# Altium project 5DPD8_OS.PrjPcb (part 2 of 2)

## Sheet 5DPD8_v1.0_OS_Sheet3.SchDoc: 5DPD8 Controller
size A4; Date: 10th Mar 14; CheckedBy: J. Wong/C. Lai; CompanyName: Makible Ltd.; DrawnBy: Martyn Kay; Engineer: Martyn Kay; Revision: 1.0; SheetNumber: 3; SheetTotal: 4; Website: 5DPrint.com; DesignFileLink: D8 Design Files; BasedOn: Printrboard Rev. B; OSHWLicense: CC BY-SA 4.0
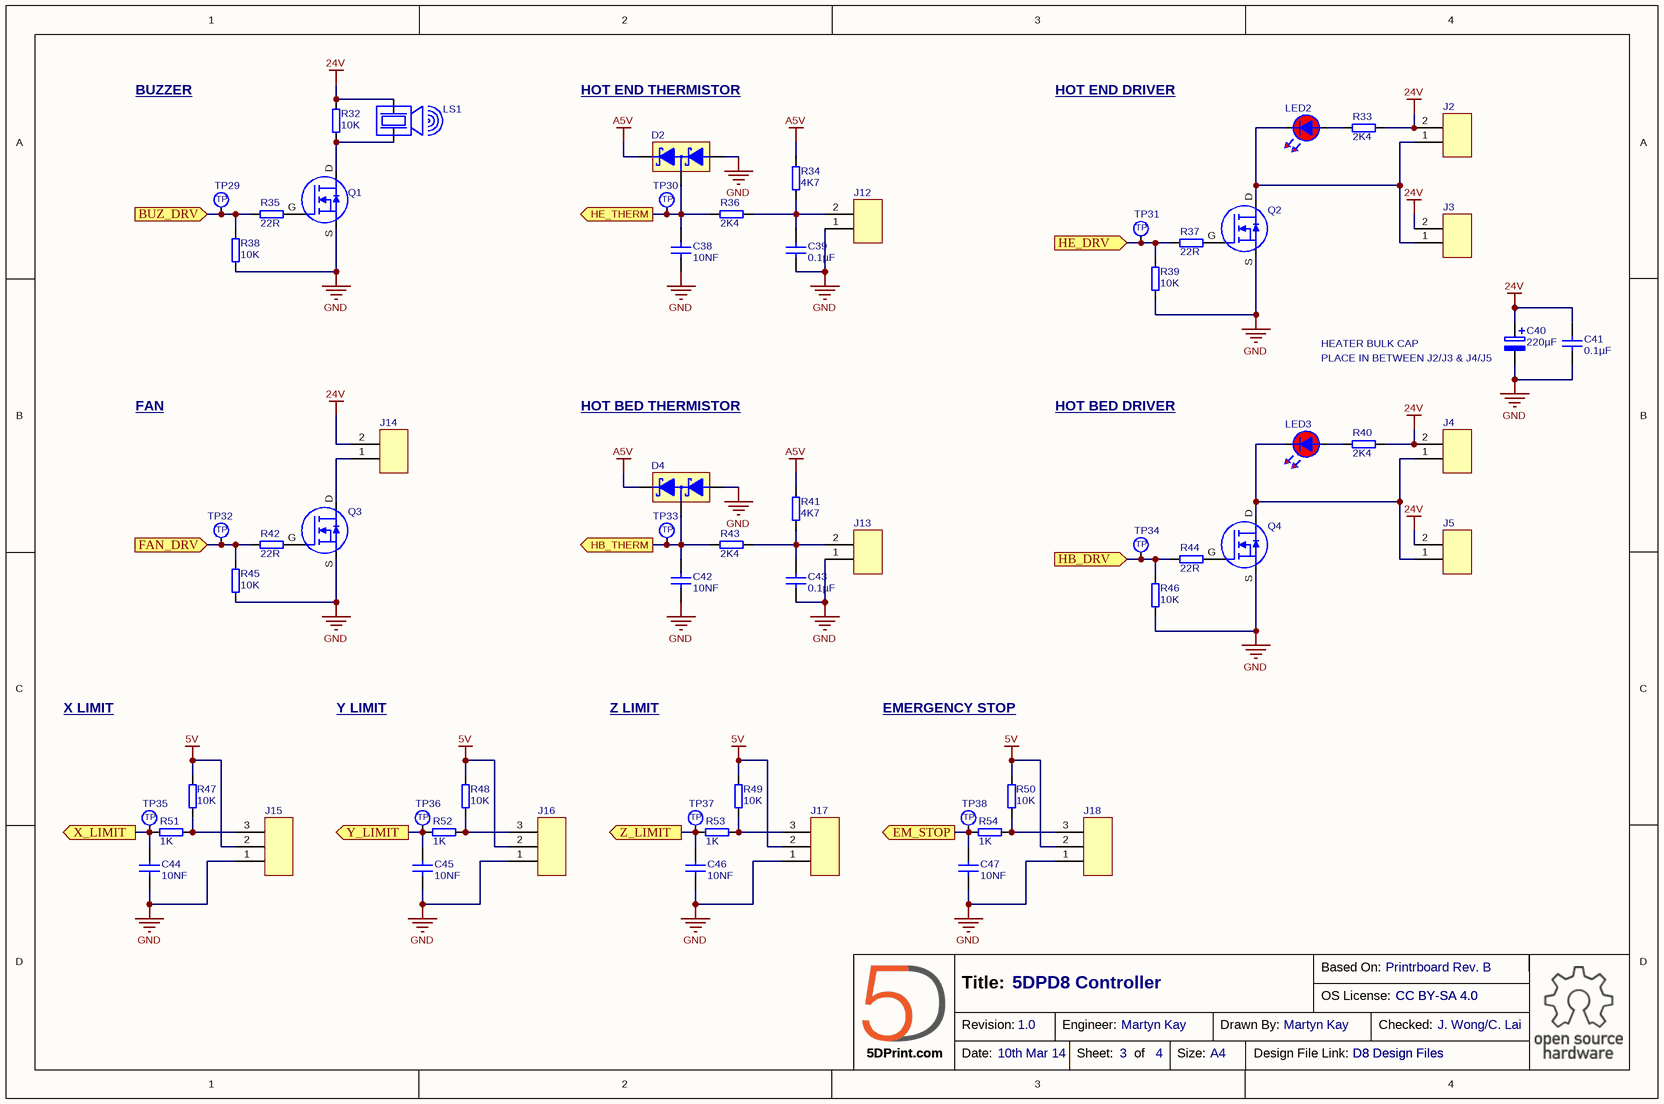
[diagram p2: 5DPD8_v1.0_OS_Sheet3.SchDoc]

### Parts
C38  10NF  [CAPC0603(1608)100_N]
C39  0.1µF  [CAPC0603(1608)100_N]
C40  220µF  [CAPRAD8X11.5]
C41  0.1µF  [CAPC0603(1608)100_N]
C42  10NF  [CAPC0603(1608)100_N]
C43  0.1µF  [CAPC0603(1608)100_N]
C44  10NF  [CAPC0603(1608)100_N]
C45  10NF  [CAPC0603(1608)100_N]
C46  10NF  [CAPC0603(1608)100_N]
C47  10NF  [CAPC0603(1608)100_N]
D2  BAT54S,215  [SOT95P237X112-3N]  (value not drawn)
D4  BAT54S,215  [SOT95P237X112-3N]  (value not drawn)
J2  0039281023  [MOLEX_39-28-1023]  (value not drawn)
J3  0039281023  [MOLEX_39-28-1023]  (value not drawn)
J4  0039281023  [MOLEX_39-28-1023]  (value not drawn)
J5  0039281023  [MOLEX_39-28-1023]  (value not drawn)
J12  0022272021  [MOLEX_22-27-2021]  (value not drawn)
J13  0022272021  [MOLEX_22-27-2021]  (value not drawn)
J14  0022272021  [MOLEX_22-27-2021]  (value not drawn)
J15  0022272031  [MOLEX_22-27-2031]  (value not drawn)
J16  0022272031  [MOLEX_22-27-2031]  (value not drawn)
J17  0022272031  [MOLEX_22-27-2031]  (value not drawn)
J18  0022272031  [MOLEX_22-27-2031]  (value not drawn)
LED2  HSMH-C190  [LEDC0603(1608)_N-RED]  (value not drawn)
LED3  HSMH-C190  [LEDC0603(1608)_N-RED]  (value not drawn)
LS1  PS1740P02E  [PS17]  (value not drawn)
Q1  2N7002,215  [SOT95P237X112-3N-GSD]  (value not drawn)
Q2  PSMN9R5-30YLC,115  [SOT669(LFPAK56)]  (value not drawn)
Q3  IRLML2060TRPBF  [SOT95P237X112-3N-GSD]  (value not drawn)
Q4  PSMN9R5-30YLC,115  [SOT669(LFPAK56)]  (value not drawn)
R32  10K  [RESC0603(1608)_N]
R33  2K4  [RESC0603(1608)_N]
R34  4K7  [RESC0603(1608)_N]
R35  22R  [RESC0603(1608)_N]
R36  2K4  [RESC0603(1608)_N]
R37  22R  [RESC0603(1608)_N]
R38  10K  [RESC0603(1608)_N]
R39  10K  [RESC0603(1608)_N]
R40  2K4  [RESC0603(1608)_N]
R41  4K7  [RESC0603(1608)_N]
R42  22R  [RESC0603(1608)_N]
R43  2K4  [RESC0603(1608)_N]
R44  22R  [RESC0603(1608)_N]
R45  10K  [RESC0603(1608)_N]
R46  10K  [RESC0603(1608)_N]
R47  10K  [RESC0603(1608)_N]
R48  10K  [RESC0603(1608)_N]
R49  10K  [RESC0603(1608)_N]
R50  10K  [RESC0603(1608)_N]
R51  1K  [RESC0603(1608)_N]
R52  1K  [RESC0603(1608)_N]
R53  1K  [RESC0603(1608)_N]
R54  1K  [RESC0603(1608)_N]
TP29  TESTPOINT  [TESTPOINT]  (value not drawn)  (no BOM)
TP30  TESTPOINT  [TESTPOINT]  (value not drawn)  (no BOM)
TP31  TESTPOINT  [TESTPOINT]  (value not drawn)  (no BOM)
TP32  TESTPOINT  [TESTPOINT]  (value not drawn)  (no BOM)
TP33  TESTPOINT  [TESTPOINT]  (value not drawn)  (no BOM)
TP34  TESTPOINT  [TESTPOINT]  (value not drawn)  (no BOM)
TP35  TESTPOINT  [TESTPOINT]  (value not drawn)  (no BOM)
TP36  TESTPOINT  [TESTPOINT]  (value not drawn)  (no BOM)
TP37  TESTPOINT  [TESTPOINT]  (value not drawn)  (no BOM)
TP38  TESTPOINT  [TESTPOINT]  (value not drawn)  (no BOM)

### Ports
BUZ_DRV (in), EM_STOP (out), FAN_DRV (in), HB_DRV (in), HB_THERM (out), HE_DRV (in), HE_THERM (out), X_LIMIT (out), Y_LIMIT (out), Z_LIMIT (out)

### Nets
5V: J15.2 J16.2 J17.2 J18.2 R47.2 R48.2 R49.2 R50.2
24V: C40.1(+) C41.2 J2.2 J3.2 J4.2 J5.2 J14.2 LS1.2 R32.2 R33.2 R40.2
A5V: D2.2 D4.2 R34.2 R41.2
GND: C38.1 C39.1 C40.2(-) C41.1 C42.1 C43.1 C44.1 C45.1 C46.1 C47.1 D2.1 D4.1 J12.1 J13.1 J15.1 J16.1 J17.1 J18.1 Q1.S Q2.S Q3.S Q4.S R38.1 R39.1 R45.1 R46.1
BUZ_DRV: R35.1 R38.2 TP29.1 ; port BUZ_DRV
EM_STOP: C47.2 R54.1 TP38.1 ; port EM_STOP
FAN_DRV: R42.1 R45.2 TP32.1 ; port FAN_DRV
HB_DRV: R44.1 R46.2 TP34.1 ; port HB_DRV
HB_THERM: C42.2 D4.3 R43.1 TP33.1 ; port HB_THERM
HE_DRV: R37.1 R39.2 TP31.1 ; port HE_DRV
HE_THERM: C38.2 D2.3 R36.1 TP30.1 ; port HE_THERM
X_LIMIT: C44.2 R51.1 TP35.1 ; port X_LIMIT
Y_LIMIT: C45.2 R52.1 TP36.1 ; port Y_LIMIT
Z_LIMIT: C46.2 R53.1 TP37.1 ; port Z_LIMIT
NetC39_2: C39.2 J12.2 R34.1 R36.2
NetC43_2: C43.2 J13.2 R41.1 R43.2
NetJ2_1: J2.1 J3.1 LED2.K Q2.D
NetJ4_1: J4.1 J5.1 LED3.K Q4.D
NetJ14_1: J14.1 Q3.D
NetJ15_3: J15.3 R47.1 R51.2
NetJ16_3: J16.3 R48.1 R52.2
NetJ17_3: J17.3 R49.1 R53.2
NetJ18_3: J18.3 R50.1 R54.2
NetLED2_A: LED2.A R33.1
NetLED3_A: LED3.A R40.1
NetLS1_1: LS1.1 Q1.D R32.1
NetQ1_G: Q1.G R35.2
NetQ2_G: Q2.G R37.2
NetQ3_G: Q3.G R42.2
NetQ4_G: Q4.G R44.2

### Notes on the sheet
- BUZZER
- HOT END THERMISTOR
- HOT END DRIVER
- FAN
- HOT BED THERMISTOR
- HOT BED DRIVER
- HEATER BULK CAP
- (near C40) PLACE IN BETWEEN J2/J3 & J4/J5
- X LIMIT
- Y LIMIT
- Z LIMIT
- EMERGENCY STOP
- Based On:
- Title:
- Revision:
- Engineer:
- Drawn By:
- OS License:
- Checked:
- Date:
- Sheet:
- of
- Size:
- A4
- Design File Link:
- (in symbol TESTPOINT) TP

### Library data of the parts
C38 C42 C44-C47 = C0603-10NF-50V-10%-X7R: CAP CER 10000PF 50V 10% X7R 0603; Manufacturer: Yageo; ManufacturerPartNumber: CC0603KPX7R9BB103; Supplier 1: Digi-Key; RoHS: RoHS Compliant; Category: Capacitors; Stock 1: 15000; Pricing 1: 15000=0.003, 30000=0.00285, 75000=0.00255, 105000=0.00206 (USD); Packaging: Tape & Reel (TR); Capacitance: 10NF; Voltage - Rated: 50V; Tolerance: ±10%; Temperature Coefficient: X7R; Mounting Type: Surface Mount, MLCC; Operating Temperature: -55°C ~ 125°C; Applications: General Purpose; Ratings: -; Package / Case: 0603 (1608 Metric); Size / Dimension: 0.063" L x 0.031" W (1.60mm x 0.80mm); Height - Seated (Max): -; Thickness (Max): 0.035" (0.90mm); Lead Spacing: -; Features: -; Lead Style: -; ComponentLink1URL: http://www.yageo.com/documents/recent/UPY-GPHC_X7R_6.3V-to-50V_8.pdf; ComponentLink1Description: http://www.yageo.com/documents/recent/UPY-GPHC_X7R_6.3V-to-50V_8.pdf; Supplier Part Number 1: 311-1572-2-ND
C39 C41 C43 = C0603-0.1UF-50V-10%-X7R: CAP CER 0.1UF 50V 10% X7R 0603; Manufacturer: Yageo; ManufacturerPartNumber: CC0603KRX7R9BB104; Supplier 1: Digi-Key; RoHS: RoHS Compliant; Category: Capacitors; Stock 1: 2096000; Pricing 1: 4000=0.00513, 8000=0.00468, 12000=0.00446, 28000=0.00424, 100000=0.00307 (USD); Packaging: Tape & Reel (TR); Capacitance: 0.1µF; Voltage - Rated: 50V; Tolerance: ±10%; Temperature Coefficient: X7R; Mounting Type: Surface Mount, MLCC; Operating Temperature: -55°C ~ 125°C; Applications: General Purpose; Ratings: -; Package / Case: 0603 (1608 Metric); Size / Dimension: 0.063" L x 0.031" W (1.60mm x 0.80mm); Height - Seated (Max): -; Thickness (Max): 0.035" (0.90mm); Lead Spacing: -; Features: -; Lead Style: -; ComponentLink1URL: http://www.yageo.com/documents/recent/UPY-GPHC_X7R_6.3V-to-50V_8.pdf; ComponentLink1Description: http://www.yageo.com/documents/recent/UPY-GPHC_X7R_6.3V-to-50V_8.pdf; Supplier Part Number 1: 311-1344-2-ND
C40 = CAP_RAD-ALU-220UF-35V-20%: CAP ALUM 220UF 35V 20% RADIAL; Manufacturer: Rubycon; ManufacturerPartNumber: 35ZLH220MEFC8X11.5; Lifetime @ Temp.: 8000 Hrs @ 105°C; Ripple Current: 945mA; Impedance: 56 mOhm; Supplier 1: Digi-Key; RoHS: RoHS Compliant; Category: Capacitors; Stock 1: 40821; Pricing 1: 1=0.41, 10=0.288, 25=0.2456, 50=0.2176, 100=0.1895, 250=0.16148, 500=0.1404, 1000=0.11934, 2500=0.11232 (USD); Packaging: Bulk; Capacitance: 220µF; Voltage Rating: 35V; Tolerance: ±20%; ESR (Equivalent Series Resistance): -; Operating Temperature: -40°C ~ 105°C; Type: -; Applications: General Purpose; Lead Spacing: 0.138" (3.50mm); Size / Dimension: 0.315" Dia (8.00mm); Height - Seated (Max): 0.512" (13.00mm); Surface Mount Land Size: -; Mounting Type: Through Hole; Package / Case: Radial, Can; ComponentLink1URL: http://www.rubycon.co.jp/EN/CATALOG/E_PDFS/ALUMINUM/E_ZLH.PDF; ComponentLink1Description: http://www.rubycon.co.jp/EN/CATALOG/E_PDFS/ALUMINUM/E_ZLH.PDF; Supplier Part Number 1: 1189-1863-ND
D2 D4 = DIO_BAT54S,215: DIODE SCHOTTKY 30V 200MA TO236AB; Manufacturer: NXP Semiconductors; Voltage - Forward (Vf) (Max) @ If: 800mV @ 100mA; Current - Reverse Leakage @ Vr: 2µA @ 25V; Current - Average Rectified (Io) (per Diode): 200mA (DC); Reverse Recovery Time (trr): 5ns; Speed: Small Signal =< 200mA (Io), Any Speed; Diode Configuration: 1 Pair Series Connection; Supplier 1: Digi-Key; ManufacturerPartNumber: BAT54S,215; RoHS: RoHS Compliant; Category: Discrete Semiconductor Products; Stock 1: 0; Pricing 1: 3000=0.0368, 6000=0.032, 15000=0.0272, 30000=0.0256, 75000=0.024, 150000=0.0208 (USD); Packaging: Tape & Reel (TR); Voltage - DC Reverse (Vr) (Max): 30V; Diode Type: Schottky; Mounting Type: Surface Mount; Package / Case: TO-236-3, SC-59, SOT-23-3; Supplier Device Package: SOT-23-3; ComponentLink1URL: http://www.nxp.com/documents/data_sheet/BAT54_SER.pdf; ComponentLink1Description: http://www.nxp.com/documents/data_sheet/BAT54_SER.pdf; Supplier Part Number 1: 568-1614-2-ND
J2-J5 = CON_MLX_39-28-1023: CONN HEADER 2POS 4.2MM VERT TIN; Manufacturer: Molex Inc; Connector Type: Header, Shrouded; Number of Positions: 2; Number of Positions Loaded: All; Row Spacing: 0.165" (4.20mm); Supplier 1: Digi-Key; ManufacturerPartNumber: 0039281023; RoHS: RoHS Compliant; Category: Connectors, Interconnects; Stock 1: 5227; Pricing 1: 1=0.97, 10=0.678, 25=0.5808, 50=0.5228, 100=0.455, 250=0.3872 (USD); Packaging: Tray; Contact Type: Male Pin; Pitch: -; Number of Rows: 2; Contact Mating Length: -; Mounting Type: Through Hole; Termination: Solder; Fastening Type: Locking Ramp; Features: -; Contact Finish: Tin; Contact Finish Thickness: 35µin (0.90µm); Color: Natural; ComponentLink1URL: http://www.molex.com/pdm_docs/sd/039281023_sd.pdf; ComponentLink1Description: http://www.molex.com/pdm_docs/sd/039281023_sd.pdf; Supplier Part Number 1: WM3800-ND
J12-J14 = CON_MLX_22-27-2021: CONN HEADER 2POS .100 VERT TIN; Manufacturer: Molex Inc; Connector Type: Header, Unshrouded; Number of Positions: 2; Number of Positions Loaded: All; Pitch: 0.100" (2.54mm); Supplier 1: Digi-Key; ManufacturerPartNumber: 0022272021; RoHS: RoHS Compliant; Category: Connectors, Interconnects; Stock 1: 7265; Pricing 1: 1=0.25, 10=0.239, 25=0.204, 50=0.1784, 100=0.1656, 250=0.14652, 500=0.14014, 1000=0.11466, 2500=0.1051 (USD); Packaging: Bulk; Contact Type: Male Pin; Number of Rows: 1; Row Spacing: -; Contact Mating Length: 0.295" (7.49mm); Mounting Type: Through Hole; Termination: Solder; Fastening Type: Friction Lock; Features: -; Contact Finish: Tin; Contact Finish Thickness: 100µin (2.54µm); Color: Natural; ComponentLink1URL: http://www.molex.com/pdm_docs/sd/022272021_sd.pdf; ComponentLink1Description: http://www.molex.com/pdm_docs/sd/022272021_sd.pdf; Supplier Part Number 1: WM4111-ND
J15-J18 = CON_MLX_22-27-2031: CONN HEADER 3POS .100 VERT TIN; Manufacturer: Molex Inc; Connector Type: Header, Unshrouded; Number of Positions: 3; Number of Positions Loaded: All; Pitch: 0.100" (2.54mm); Supplier 1: Digi-Key; ManufacturerPartNumber: 0022272031; RoHS: RoHS Compliant; Category: Connectors, Interconnects; Stock 1: 24251; Pricing 1: 1=0.37, 10=0.351, 25=0.3008, 50=0.2558, 100=0.2457, 250=0.22068, 500=0.21064, 1000=0.17553, 2500=0.16048 (USD); Packaging: Bulk; Contact Type: Male Pin; Number of Rows: 1; Row Spacing: -; Contact Mating Length: 0.295" (7.49mm); Mounting Type: Through Hole; Termination: Solder; Fastening Type: Friction Lock; Features: -; Contact Finish: Tin; Contact Finish Thickness: 100µin (2.54µm); Color: Natural; ComponentLink1URL: http://www.molex.com/pdm_docs/sd/022272031_sd.pdf; ComponentLink1Description: http://www.molex.com/pdm_docs/sd/022272031_sd.pdf; Supplier Part Number 1: WM4112-ND
LED2 LED3 = LED_HSMH-C190: LED 660NM RED DIFF 0603 SMD; Manufacturer: Avago Technologies US Inc.; Wavelength - Dominant: 639nm; Millicandela Rating: 17mcd; Voltage - Forward (Vf) Typ: 1.8V; Current - Test: 20mA; Viewing Angle: 170°; Lens Type: Diffused; Lens Style/Size: Rectangle with Flat Top, 1mm x 0.8mm; Supplier 1: Digi-Key; ManufacturerPartNumber: HSMH-C190; RoHS: RoHS Compliant; Category: Optoelectronics; Stock 1: 12000; Pricing 1: 4000=0.08, 8000=0.072, 12000=0.064, 28000=0.06, 100000=0.052 (USD); Packaging: Tape & Reel (TR); Color: Red; Wavelength - Peak: 660nm; Package / Case: 0603 (1608 Metric); Size / Dimension: 1.60mm L x 0.80mm W; Height: 0.80mm; Mounting Type: Surface Mount; Luminous Flux @ Current - Test: -; ComponentLink1URL: http://www.avagotech.com/docs/AV02-0551EN; ComponentLink1Description: http://www.avagotech.com/docs/AV02-0551EN; Supplier Part Number 1: 516-1420-2-ND
LS1 = LS_PS1740P02E: BUZZER PIEZO 4KHZ 17MM PC MOUNT; Manufacturer: TDK Corporation; Driver Circuitry: Transducer, Externally Driven; Input Type: zero-peak Signal; Voltage - Rated: 3Vo-p; Voltage Range: 30V (Max); Operating Mode: Continuous; Sound Pressure Level: 75dB @ 3V, 10cm; Washable: No; Supplier 1: Digi-Key; ManufacturerPartNumber: PS1740P02E; RoHS: RoHS Compliant; Category: Audio Products; Stock 1: 7645; Pricing 1: 1=0.56, 10=0.486, 100=0.3035, 250=0.2948, 500=0.28612, 1000=0.2601, 5000=0.23409, 10000=0.22542 (USD); Packaging: Bulk; Technology: Piezo; Frequency: 4kHz; Current - Supply: -; Mounting Type: Through Hole; Termination: PC Pins; Size / Dimension: Circular - 17.00mm Dia x 7.80mm H; Capacitance @ Frequency: -; Operating Temperature: -10°C ~ 70°C; ComponentLink1URL: http://www.tdk.co.jp/tefe02/ef532_ps.pdf; ComponentLink1Description: http://www.tdk.co.jp/tefe02/ef532_ps.pdf; Supplier Part Number 1: 445-2528-ND
Q1 = FET_2N7002,215: MOSFET N-CH 60V 300MA SOT-23; Manufacturer: NXP Semiconductors; FET Type: MOSFET N-Channel, Metal Oxide; FET Feature: Logic Level Gate; Current - Continuous Drain (Id) @ 25°C: 300mA (Ta); Rds On (Max) @ Id, Vgs: 5 Ohm @ 500mA, 10V; Vgs(th) (Max) @ Id: 2.5V @ 250µA; Input Capacitance (Ciss) @ Vds: 50pF @ 10V; Power - Max: 830mW; Supplier 1: Digi-Key; ManufacturerPartNumber: 2N7002,215; RoHS: RoHS Compliant; Category: Discrete Semiconductor Products; Stock 1: 799941; Pricing 1: 1=0.15, 10=0.142, 25=0.1288, 100=0.0927, 250=0.0546, 500=0.0453, 1000=0.0309 (USD); Packaging: Digi-Reel®; Drain to Source Voltage (Vdss): 60V; Gate Charge (Qg) @ Vgs: -; Mounting Type: Surface Mount; Package / Case: TO-236-3, SC-59, SOT-23-3; Supplier Device Package: SOT-23-3; ComponentLink1URL: http://www.nxp.com/documents/data_sheet/2N7002.pdf; ComponentLink1Description: http://www.nxp.com/documents/data_sheet/2N7002.pdf; Supplier Part Number 1: 568-1369-6-ND
Q2 Q4 = FET_PSMN9R5-30YLC,115: MOSFET N-CH 30V 44A LL LFPAK; Manufacturer: NXP Semiconductors; FET Type: MOSFET N-Channel, Metal Oxide; FET Feature: Logic Level Gate; Current - Continuous Drain (Id) @ 25° C: 44A (Tmb); Rds On (Max) @ Id, Vgs: 9.8 mOhm @ 15A, 10V; Vgs(th) (Max) @ Id: 1.95V @ 1mA; Gate Charge (Qg) @ Vgs: 10.4nC @ 10V; Input Capacitance (Ciss) @ Vds: 681pF @ 15V; Power - Max: 34W; Supplier 1: Digi-Key; ManufacturerPartNumber: PSMN9R5-30YLC,115; RoHS: RoHS Compliant; Category: Discrete Semiconductor Products; Stock 1: 1500; Pricing 1: 1500=0.19635, 3000=0.17903, 7500=0.16747, 10500=0.15592, 37500=0.14784, 75000=0.14438, 150000=0.1386 (USD); Packaging: Tape & Reel (TR); Drain to Source Voltage (Vdss): 30V; Mounting Type: Surface Mount; Package / Case: SC-100, SOT-669, 4-LFPAK; Supplier Device Package: LFPAK56, Power-SO8; ComponentLink1URL: http://www.nxp.com/documents/data_sheet/PSMN9R5-30YLC.pdf; ComponentLink1Description: http://www.nxp.com/documents/data_sheet/PSMN9R5-30YLC.pdf; Supplier Part Number 1: 568-7593-2-ND
Q3 = FET_IRLML2060TRPBF: MOSFET N-CH 60V 1.2A SOT23-3; Manufacturer: International Rectifier; FET Type: MOSFET N-Channel, Metal Oxide; FET Feature: Logic Level Gate; Current - Continuous Drain (Id) @ 25° C: 1.2A (Ta); Rds On (Max) @ Id, Vgs: 480 mOhm @ 1.2A, 10V; Vgs(th) (Max) @ Id: 2.5V @ 25µA; Gate Charge (Qg) @ Vgs: 0.67nC @ 4.5V; Input Capacitance (Ciss) @ Vds: 64pF @ 25V; Power - Max: 1.25W; Supplier 1: Digi-Key; ManufacturerPartNumber: IRLML2060TRPBF; RoHS: RoHS Compliant; Category: Discrete Semiconductor Products; Stock 1: 21000; Pricing 1: 3000=0.08741, 6000=0.0819, 15000=0.07837, 30000=0.07532, 75000=0.07173, 150000=0.06921 (USD); Packaging: Tape & Reel (TR); Drain to Source Voltage (Vdss): 60V; Mounting Type: Surface Mount; Package / Case: TO-236-3, SC-59, SOT-23-3; Supplier Device Package: Micro3™/SOT-23; ComponentLink1URL: http://www.irf.com/product-info/datasheets/data/irlml2060pbf.pdf; ComponentLink1Description: http://www.irf.com/product-info/datasheets/data/irlml2060pbf.pdf; Supplier Part Number 1: IRLML2060TRPBFTR-ND
R32 R38 R39 R45-R50 = R0603-10K-0.1W-5%: RES 10K OHM 1/10W 5% 0603 SMD; Manufacturer: Yageo; ManufacturerPartNumber: RC0603JR-0710KL; Power (Watts): 0.1W, 1/10W; Temperature Coefficient: ±100ppm/°C; Supplier 1: Digi-Key; RoHS: RoHS Compliant; Category: Resistors; Stock 1: 0; Pricing 1: 5000=0.00131, 10000=0.00114, 25000=0.001, 50000=0.00092, 125000=0.0009 (USD); Packaging: Tape & Reel (TR); Resistance: 10K; Tolerance: ±5%; Composition: Thick Film; Features: -; Package / Case: 0603 (1608 Metric); Supplier Device Package: 0603; Size / Dimension: 0.063" L x 0.031" W (1.60mm x 0.80mm); Height: 0.022" (0.55mm); Number of Terminations: 2; ComponentLink1URL: http://www.yageo.com/documents/recent/PYu-RC0603_51_RoHS_L_4.pdf; ComponentLink1Description: http://www.yageo.com/documents/recent/PYu-RC0603_51_RoHS_L_4.pdf; Supplier Part Number 1: 311-10KGRTR-ND
R33 R36 R40 R43 = R0603-2K4-0.25W-5%: RES 2.4K OHM 1/4W 5% 0603 SMD; Manufacturer: Rohm Semiconductor; ManufacturerPartNumber: ESR03EZPJ242; Power (Watts): 0.25W, 1/4W; Temperature Coefficient: ±200ppm/°C; Supplier 1: Digi-Key; RoHS: RoHS Compliant; Category: Resistors; Stock 1: 10000; Pricing 1: 5000=0.00935, 10000=0.00839, 25000=0.0077, 50000=0.00723, 125000=0.00707 (USD); Packaging: Tape & Reel (TR); Resistance: 2K4; Tolerance: ±5%; Composition: Thick Film; Features: Pulse Withstanding; Package / Case: 0603 (1608 Metric); Supplier Device Package: 0603 (1608 Metric); Size / Dimension: 0.063" L x 0.031" W (1.60mm x 0.80mm); Height: 0.022" (0.55mm); Number of Terminations: 2; ComponentLink1URL: http://rohmfs.rohm.com/en/products/databook/datasheet/passive/resistor/chip_resistor/esr.pdf; ComponentLink1Description: http://rohmfs.rohm.com/en/products/databook/datasheet/passive/resistor/chip_resistor/esr.pdf; Supplier Part Number 1: RHM2.4KDTR-ND
R34 R41 = R0603-4K7-0.1W-1%: RES 4.70K OHM 1/10W 1% 0603 SMD; Manufacturer: Yageo; ManufacturerPartNumber: RC0603FR-074K7L; Power (Watts): 0.1W, 1/10W; Temperature Coefficient: ±100ppm/°C; Supplier 1: Digi-Key; RoHS: RoHS Compliant; Category: Resistors; Stock 1: 0; Pricing 1: 5000=0.00171, 10000=0.00149, 25000=0.00131, 50000=0.0012, 125000=0.00117 (USD); Packaging: Tape & Reel (TR); Resistance: 4K7; Tolerance: ±1%; Composition: Thick Film; Features: -; Package / Case: 0603 (1608 Metric); Supplier Device Package: 0603; Size / Dimension: 0.063" L x 0.031" W (1.60mm x 0.80mm); Height: 0.022" (0.55mm); Number of Terminations: 2; ComponentLink1URL: http://www.yageo.com/documents/recent/PYu-RC0603_51_RoHS_L_4.pdf; ComponentLink1Description: http://www.yageo.com/documents/recent/PYu-RC0603_51_RoHS_L_4.pdf; Supplier Part Number 1: 311-4.70KHRTR-ND
R35 R37 R42 R44 = R0603-22R-0.1W-1%: RES 22.0 OHM 1/10W 1% 0603 SMD; Manufacturer: Yageo; ManufacturerPartNumber: RC0603FR-0722RL; Power (Watts): 0.1W, 1/10W; Temperature Coefficient: ±100ppm/°C; Supplier 1: Digi-Key; RoHS: RoHS Compliant; Category: Resistors; Stock 1: 45000; Pricing 1: 5000=0.00171, 10000=0.00149, 25000=0.00131, 50000=0.0012, 125000=0.00117 (USD); Packaging: Tape & Reel (TR); Resistance: 22R; Tolerance: ±1%; Composition: Thick Film; Features: -; Package / Case: 0603 (1608 Metric); Supplier Device Package: 0603; Size / Dimension: 0.063" L x 0.031" W (1.60mm x 0.80mm); Height: 0.022" (0.55mm); Number of Terminations: 2; ComponentLink1URL: http://www.yageo.com/documents/recent/PYu-RC0603_51_RoHS_L_4.pdf; ComponentLink1Description: http://www.yageo.com/documents/recent/PYu-RC0603_51_RoHS_L_4.pdf; Supplier Part Number 1: 311-22.0HRTR-ND
R51-R54 = R0603-1K-0.1W-1%: RES 1.00K OHM 1/10W 1% 0603 SMD; Manufacturer: Yageo; ManufacturerPartNumber: RC0603FR-071KL; Power (Watts): 0.1W, 1/10W; Temperature Coefficient: ±100ppm/°C; Supplier 1: Digi-Key; RoHS: RoHS Compliant; Category: Resistors; Stock 1: 1620000; Pricing 1: 5000=0.00171, 10000=0.00149, 25000=0.00131, 50000=0.0012, 125000=0.00117 (USD); Packaging: Tape & Reel (TR); Resistance: 1K; Tolerance: ±1%; Composition: Thick Film; Features: -; Package / Case: 0603 (1608 Metric); Supplier Device Package: 0603; Size / Dimension: 0.063" L x 0.031" W (1.60mm x 0.80mm); Height: 0.022" (0.55mm); Number of Terminations: 2; ComponentLink1URL: http://www.yageo.com/documents/recent/PYu-RC0603_51_RoHS_L_4.pdf; ComponentLink1Description: http://www.yageo.com/documents/recent/PYu-RC0603_51_RoHS_L_4.pdf; Supplier Part Number 1: 311-1.00KHRTR-ND

## Sheet 5DPD8_v1.0_OS_Sheet4.SchDoc: 5DPD8 Controller
size A4; Date: 10th Mar 14; CheckedBy: J. Wong/C. Lai; CompanyName: Makible Ltd.; DrawnBy: Martyn Kay; Engineer: Martyn Kay; Revision: 1.0; SheetNumber: 4; SheetTotal: 4; Website: 5DPrint.com; DesignFileLink: D8 Design Files; BasedOn: Printrboard Rev. B; OSHWLicense: CC BY-SA 4.0
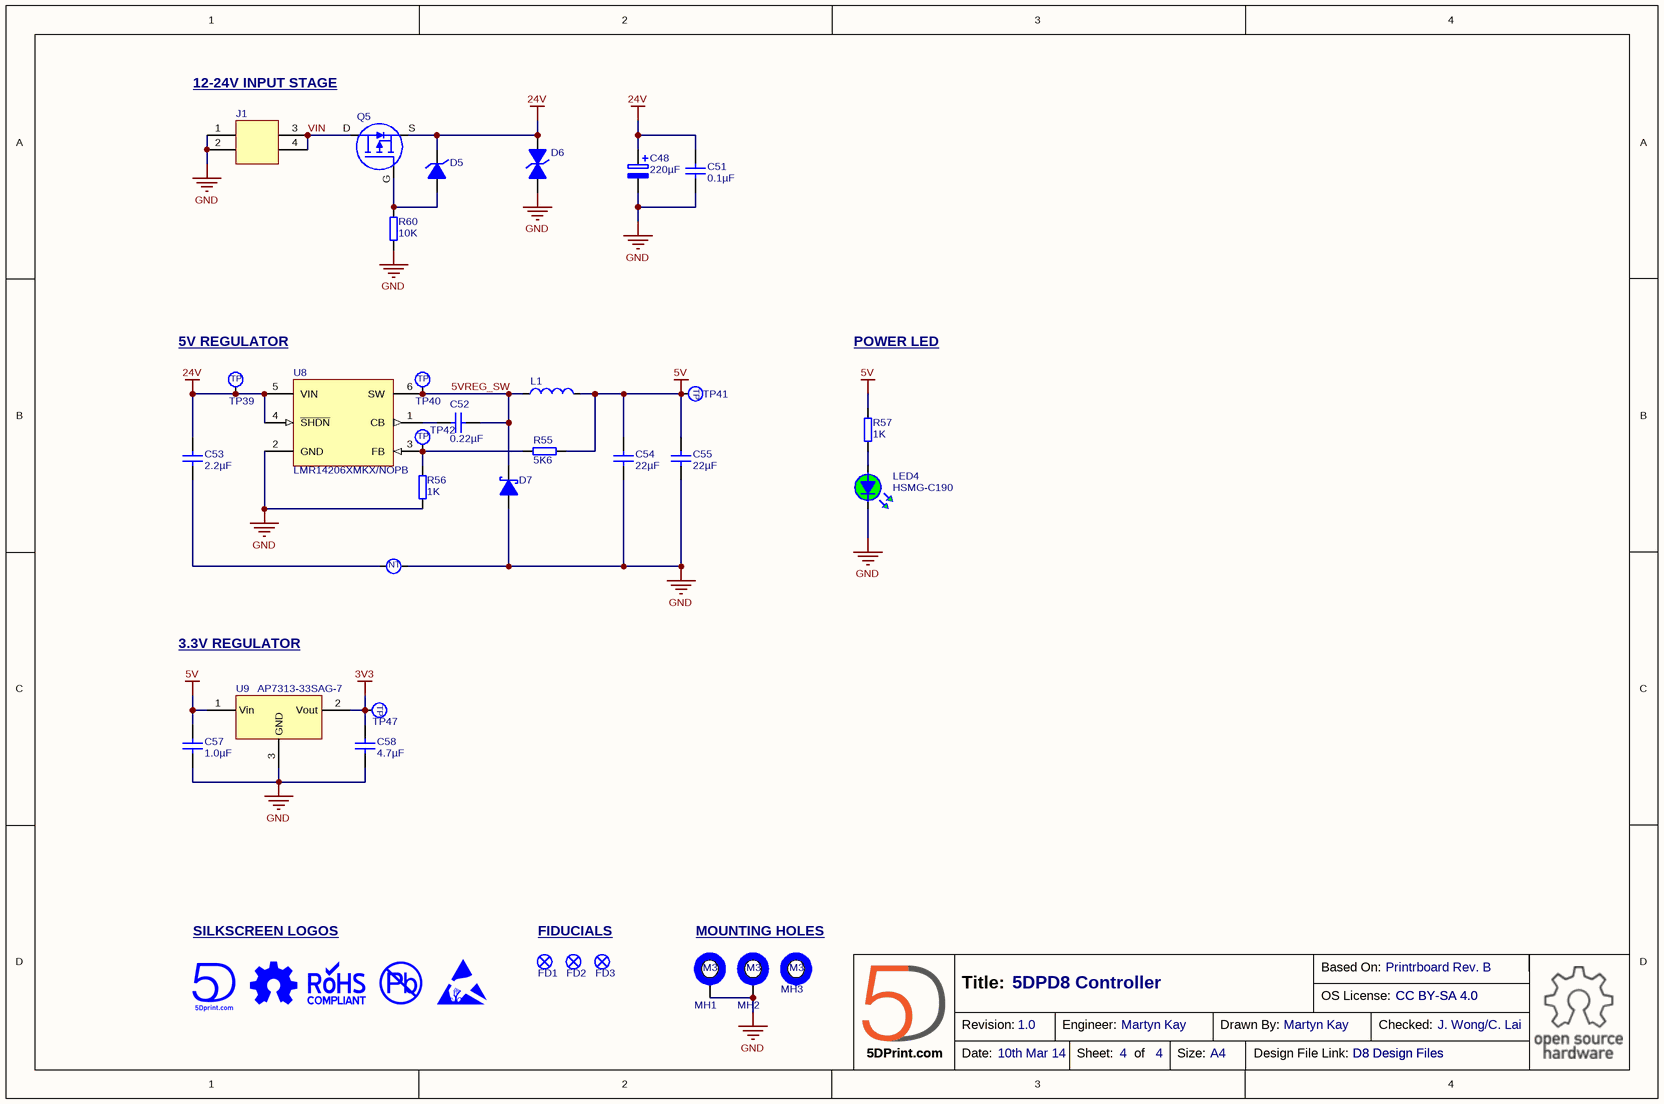
[diagram p3: 5DPD8_v1.0_OS_Sheet4.SchDoc]

### Parts
C48  220µF  [CAPRAD8X11.5]
C51  0.1µF  [CAPC0603(1608)100_N]
C52  0.22µF  [CAPC0603(1608)100_N]
C53  2.2µF  [CAPC0805(2012)145_N]
C54  22µF  [CAPC0805(2012)145_N]
C55  22µF  [CAPC0805(2012)145_N]
C57  1.0µF  [CAPC0603(1608)100_N]
C58  4.7µF  [CAPC0603(1608)100_N]
D5  BZV55-C10,115  [DIOMELF3515N]  (value not drawn)
D6  SMAJ24CA  [DIOM4326X23N-BI]  (value not drawn)
D7  B140-13-F  [DIOM4326X23N-UNI]  (value not drawn)
FD1  MECH_FIDUCIAL  [FIDUCIAL-1MM]  (value not drawn)  (no BOM)
FD2  MECH_FIDUCIAL  [FIDUCIAL-1MM]  (value not drawn)  (no BOM)
FD3  MECH_FIDUCIAL  [FIDUCIAL-1MM]  (value not drawn)  (no BOM)
J1  0039281043  [MOLEX_39-28-1043]  (value not drawn)
L1  SRN6045-220M  [INDP6060X45N]  (value not drawn)
LED4  HSMG-C190  [LEDC0603(1608)_N-GRN]
LG1  5DPRINT  [5DPRINT-10MM]  (value not drawn)  (no BOM)
LG2  ESD  [ESD-5MM]  (value not drawn)  (no BOM)
LG3  LEADFREE  [LEADFREE-5MM]  (value not drawn)  (no BOM)
LG4  OSHW_COG  [OSHW_COG-5MM]  (value not drawn)  (no BOM)
LG6  RoHS  [RoHS-5MM]  (value not drawn)  (no BOM)
MH1  MECH_MH-M3  [M3 MOUNT-3.4MM]  (value not drawn)  (no BOM)
MH2  MECH_MH-M3  [M3 MOUNT-3.4MM]  (value not drawn)  (no BOM)
MH3  MECH_MH-M3-NP  [M3 MOUNT-3.4MM-NOPAD]  (value not drawn)  (no BOM)
NT1  NET_TIE  [NET_TIE-2NET_12MM]  (value not drawn)  (net tie, no BOM)
Q5  SIS427EDN-T1-GE3  [POWERPAK1212-8S]  (value not drawn)
R55  5K6  [RESC0603(1608)_N]
R56  1K  [RESC0603(1608)_N]
R57  1K  [RESC0603(1608)_N]
R60  10K  [RESC0603(1608)_N]
TP39  TESTPOINT  [TESTPOINT]  (value not drawn)  (no BOM)
TP40  TESTPOINT  [TESTPOINT]  (value not drawn)  (no BOM)
TP41  TESTPOINT  [TESTPOINT]  (value not drawn)  (no BOM)
TP42  TESTPOINT  [TESTPOINT]  (value not drawn)  (no BOM)
TP47  TESTPOINT  [TESTPOINT]  (value not drawn)  (no BOM)
U8  LMR14206XMKX/NOPB  [MK06A_N]
U9  AP7313-33SAG-7  [SOT95P237X112-3N]

### Nets
3V3: C58.2 TP47.1 U9.2(Vout)
5V: C54.2 C55.2 C57.2 L1.2 R55.2 R57.2 TP41.1 U9.1(Vin)
24V: C48.1(+) C51.2 C53.2 D5.K D6.1 Q5.S TP39.1 U8.4(~{SHDN}) U8.5(VIN)
GND: C48.2(-) C51.1 C54.1 C55.1 C57.1 C58.1 D6.2 D7.A J1.1 J1.2 LED4.K MH1.MH MH2.MH NT1.2 R56.1 R60.1 U8.2(GND) U9.3(GND)
5VREG_SW: C52.2 D7.K L1.1 TP40.1 U8.6(SW)
VIN: J1.3 J1.4 Q5.D
NetC52_1: C52.1 U8.1(CB)
NetC53_1: C53.1 NT1.1
NetD5_A: D5.A Q5.G R60.2
NetLED4_A: LED4.A R57.1
NetR55_1: R55.1 R56.2 TP42.1 U8.3(FB)

### Notes on the sheet
- 12-24V INPUT STAGE
- 5V REGULATOR
- POWER LED
- 3.3V REGULATOR
- SILKSCREEN LOGOS
- FIDUCIALS
- MOUNTING HOLES
- Based On:
- Title:
- Revision:
- Engineer:
- Drawn By:
- OS License:
- Checked:
- Date:
- Sheet:
- of
- Size:
- A4
- Design File Link:
- (in symbol MECH_MH-M3) M3
- (in symbol MECH_MH-M3-NP) M3
- (in symbol NET_TIE) NT
- (in symbol TESTPOINT) TP

### Library data of the parts
C48 = CAP_RAD-ALU-220UF-35V-20%: as C40 on sheet 5DPD8_v1.0_OS_Sheet3; Supplier 1: Digi-Key; RoHS: RoHS Compliant; Category: Capacitors; Stock 1: 40821; Pricing 1: 1=0.41, 10=0.288, 25=0.2456, 50=0.2176, 100=0.1895, 250=0.16148, 500=0.1404, 1000=0.11934, 2500=0.11232 (USD); Packaging: Bulk; Capacitance: 220µF; Voltage Rating: 35V; Tolerance: ±20%; ESR (Equivalent Series Resistance): -; Operating Temperature: -40°C ~ 105°C; Type: -; Applications: General Purpose; Lead Spacing: 0.138" (3.50mm); Size / Dimension: 0.315" Dia (8.00mm); Height - Seated (Max): 0.512" (13.00mm); Surface Mount Land Size: -; Mounting Type: Through Hole; Package / Case: Radial, Can; ComponentLink1URL: http://www.rubycon.co.jp/EN/CATALOG/E_PDFS/ALUMINUM/E_ZLH.PDF; ComponentLink1Description: http://www.rubycon.co.jp/EN/CATALOG/E_PDFS/ALUMINUM/E_ZLH.PDF; Supplier Part Number 1: 1189-1863-ND
C51 = C0603-0.1UF-50V-10%-X7R: as C39 on sheet 5DPD8_v1.0_OS_Sheet3; Supplier 1: Digi-Key; RoHS: RoHS Compliant; Category: Capacitors; Stock 1: 2096000; Pricing 1: 4000=0.00513, 8000=0.00468, 12000=0.00446, 28000=0.00424, 100000=0.00307 (USD); Packaging: Tape & Reel (TR); Capacitance: 0.1µF; Voltage - Rated: 50V; Tolerance: ±10%; Temperature Coefficient: X7R; Mounting Type: Surface Mount, MLCC; Operating Temperature: -55°C ~ 125°C; Applications: General Purpose; Ratings: -; Package / Case: 0603 (1608 Metric); Size / Dimension: 0.063" L x 0.031" W (1.60mm x 0.80mm); Height - Seated (Max): -; Thickness (Max): 0.035" (0.90mm); Lead Spacing: -; Features: -; Lead Style: -; ComponentLink1URL: http://www.yageo.com/documents/recent/UPY-GPHC_X7R_6.3V-to-50V_8.pdf; ComponentLink1Description: http://www.yageo.com/documents/recent/UPY-GPHC_X7R_6.3V-to-50V_8.pdf; Supplier Part Number 1: 311-1344-2-ND
C52 = C0603-0.22UF-50V-10%-X7R: CAP CER 0.22UF 50V 10% X7R 0603; Manufacturer: TDK Corporation; ManufacturerPartNumber: C1608X7R1H224K080AB; Supplier 1: Digi-Key; RoHS: RoHS Compliant; Category: Capacitors; Stock 1: 116000; Pricing 1: 4000=0.03, 8000=0.0285, 12000=0.027, 28000=0.0255, 100000=0.02025 (USD); Packaging: Tape & Reel (TR); Capacitance: 0.22µF; Voltage - Rated: 50V; Tolerance: ±10%; Temperature Coefficient: X7R; Mounting Type: Surface Mount, MLCC; Operating Temperature: -55°C ~ 125°C; Applications: General Purpose; Ratings: -; Package / Case: 0603 (1608 Metric); Size / Dimension: 0.063" L x 0.031" W (1.60mm x 0.80mm); Height - Seated (Max): -; Thickness (Max): 0.035" (0.90mm); Lead Spacing: -; Features: -; Lead Style: -; ComponentLink1URL: http://product.tdk.com/capacitor/mlcc/en/documents/mlcc_commercial_general_en.pdf; ComponentLink1Description: http://product.tdk.com/capacitor/mlcc/en/documents/mlcc_commercial_general_en.pdf; Supplier Part Number 1: 445-7408-2-ND
C53 = C0805-2.2UF-50V-10%-X7R: CAP CER 2.2UF 50V 10% X7R 0805; Manufacturer: Taiyo Yuden; ManufacturerPartNumber: UMK212BB7225KG-T; Supplier 1: Digi-Key; RoHS: RoHS Compliant; Category: Capacitors; Stock 1: 0; Pricing 1: 3000=0.05, 6000=0.04625, 9000=0.04375, 15000=0.0415, 30000=0.04, 75000=0.0375, 150000=0.03313 (USD); Packaging: Tape & Reel (TR); Capacitance: 2.2µF; Voltage - Rated: 50V; Tolerance: ±10%; Temperature Coefficient: X7R; Mounting Type: Surface Mount, MLCC; Operating Temperature: -55°C ~ 125°C; Applications: General Purpose; Ratings: -; Package / Case: 0805 (2012 Metric); Size / Dimension: 0.079" L x 0.049" W (2.00mm x 1.25mm); Height - Seated (Max): -; Thickness (Max): 0.057" (1.45mm); Lead Spacing: -; Features: -; Lead Style: -; Supplier Part Number 1: 587-3169-2-ND
C54 C55 = C0805-22UF-10V-10%-X5R: CAP CER 22UF 10V 10% X5R 0805; Manufacturer: TDK Corporation; ManufacturerPartNumber: C2012X5R1A226K125AB; Supplier 1: Digi-Key; RoHS: RoHS Compliant; Category: Capacitors; Stock 1: 22000; Pricing 1: 2000=0.16, 4000=0.15, 10000=0.14, 14000=0.1375, 50000=0.13, 100000=0.125 (USD); Packaging: Tape & Reel (TR); Capacitance: 22µF; Voltage - Rated: 10V; Tolerance: ±10%; Temperature Coefficient: X5R; Mounting Type: Surface Mount, MLCC; Operating Temperature: -55°C ~ 85°C; Applications: General Purpose; Ratings: -; Package / Case: 0805 (2012 Metric); Size / Dimension: 0.079" L x 0.049" W (2.00mm x 1.25mm); Height - Seated (Max): -; Thickness (Max): 0.057" (1.45mm); Lead Spacing: -; Features: -; Lead Style: -; ComponentLink1URL: http://product.tdk.com/capacitor/mlcc/en/documents/mlcc_commercial_general_en.pdf; ComponentLink1Description: http://product.tdk.com/capacitor/mlcc/en/documents/mlcc_commercial_general_en.pdf; Supplier Part Number 1: 445-7664-2-ND
C57 = C0603-1UF-10V-10%-X7R: CAP CER 1UF 10V 10% X7R 0603; Manufacturer: Taiyo Yuden; ManufacturerPartNumber: LMK107B7105KA-T; Supplier 1: Digi-Key; RoHS: RoHS Compliant; Category: Capacitors; Stock 1: 116000; Pricing 1: 4000=0.00782, 8000=0.00714, 12000=0.0068, 28000=0.00646 (USD); Packaging: Tape & Reel (TR); Capacitance: 1.0µF; Voltage - Rated: 10V; Tolerance: ±10%; Temperature Coefficient: X7R; Mounting Type: Surface Mount, MLCC; Operating Temperature: -55°C ~ 125°C; Applications: General Purpose; Ratings: -; Package / Case: 0603 (1608 Metric); Size / Dimension: 0.063" L x 0.031" W (1.60mm x 0.80mm); Height - Seated (Max): -; Thickness (Max): 0.035" (0.90mm); Lead Spacing: -; Features: -; Lead Style: -; ComponentLink1URL: http://www.yuden.co.jp/or/product/category/capacitor/LMK107B7105KA-T.pdf; ComponentLink1Description: http://www.yuden.co.jp/or/product/category/capacitor/LMK107B7105KA-T.pdf; Supplier Part Number 1: 587-1242-2-ND
C58 = C0603-4.7UF-6.3V-10%-X5R: CAP CER 4.7UF 6.3V 10% X5R 0603; Manufacturer: Taiyo Yuden; ManufacturerPartNumber: JMK107BJ475KA-T; Supplier 1: Digi-Key; RoHS: RoHS Compliant; Category: Capacitors; Stock 1: 1856000; Pricing 1: 4000=0.01935, 8000=0.018, 12000=0.0171, 28000=0.0162 (USD); Packaging: Tape & Reel (TR); Capacitance: 4.7µF; Voltage - Rated: 6.3V; Tolerance: ±10%; Temperature Coefficient: X5R; Mounting Type: Surface Mount, MLCC; Operating Temperature: -55°C ~ 85°C; Applications: General Purpose; Ratings: -; Package / Case: 0603 (1608 Metric); Size / Dimension: 0.063" L x 0.031" W (1.60mm x 0.80mm); Height - Seated (Max): -; Thickness (Max): 0.035" (0.90mm); Lead Spacing: -; Features: -; Lead Style: -; ComponentLink1URL: http://www.yuden.co.jp/or/product/category/capacitor/JMK107BJ475KA-T.pdf; ComponentLink1Description: http://www.yuden.co.jp/or/product/category/capacitor/JMK107BJ475KA-T.pdf; Supplier Part Number 1: 587-1785-2-ND
D5 = DIO_BZV55-C10,115: DIODE ZENER 10V 500MW LLDS; Manufacturer: NXP Semiconductors; Tolerance: ±5%; Current - Reverse Leakage @ Vr: 200nA @ 7V; Impedance (Max) (Zzt): 20 Ohm; Voltage - Forward (Vf) (Max) @ If: 900mV @ 10mA; Supplier 1: Digi-Key; ManufacturerPartNumber: BZV55-C10,115; RoHS: RoHS Compliant; Category: Discrete Semiconductor Products; Stock 1: 14344; Pricing 1: 1=0.2, 10=0.184, 25=0.1676, 100=0.1205, 250=0.071, 500=0.0589, 1000=0.04017 (USD); Packaging: Cut Tape (CT); Voltage - Zener (Nom) (Vz): 10V; Power - Max: 500mW; Operating Temperature: -65°C ~ 200°C; Mounting Type: Surface Mount; Package / Case: SOD-80C; Supplier Device Package: LLDS; MiniMelf; ComponentLink1URL: http://www.nxp.com/documents/data_sheet/BZV55_SER.pdf; ComponentLink1Description: http://www.nxp.com/documents/data_sheet/BZV55_SER.pdf; Supplier Part Number 1: 568-6253-1-ND
D6 = DIO_SMAJ24CA: DIODE TVS 24V 400W BIDIR 5% SMA; Manufacturer: Littelfuse Inc; Voltage - Breakdown: 26.7V; Polarization: Bidirectional; Supplier 1: Digi-Key; ManufacturerPartNumber: SMAJ24CA; RoHS: RoHS Compliant; Category: Circuit Protection; Stock 1: 20000; Pricing 1: 5000=0.12572, 10000=0.11705, 25000=0.11098 (USD); Packaging: Tape & Reel (TR); Voltage - Reverse Standoff (Typ): 24V; Power (Watts): 400W; Mounting Type: Surface Mount; Package / Case: DO-214AC, SMA; Supplier Device Package: SMA; ComponentLink1URL: http://www.littelfuse.com/~/media/Electronics_Technical/Datasheets/TVS_Diodes/Littelfuse_TVS_Diode_SMAJ_Datasheet.pdf; ComponentLink1Description: http://www.littelfuse.com/~/media/Electronics_Technical/Datasheets/TVS_Diodes/Littelfuse_TVS_Diode_SMAJ_Datasheet.pdf; Supplier Part Number 1: SMAJ24CALFTR-ND
D7 = DIO_B140-13-F: DIODE SCHOTTKY 40V 1A SMA; Manufacturer: Diodes Inc; Voltage - Forward (Vf) (Max) @ If: 500mV @ 1A; Speed: Fast Recovery =< 500ns, > 200mA (Io); Current - Reverse Leakage @ Vr: 500µA @ 40V; Capacitance @ Vr, F: 110pF @ 4V, 1MHz; Thermal Resistance: 20°C/W Jl; Supplier 1: Digi-Key; ManufacturerPartNumber: B140-13-F; RoHS: RoHS Compliant; Category: Discrete Semiconductor Products; Stock 1: 130000; Pricing 1: 5000=0.063, 10000=0.056, 25000=0.0525, 50000=0.04655, 125000=0.04375 (USD); Packaging: Tape & Reel (TR); Diode Type: Schottky; Voltage - DC Reverse (Vr) (Max): 40V; Current - Average Rectified (Io): 1A; Reverse Recovery Time (trr): -; Mounting Type: Surface Mount; Package / Case: DO-214AC, SMA; Supplier Device Package: SMA; Operating Temperature - Junction: -65°C ~ 150°C; ComponentLink1URL: http://www.diodes.com/datasheets/ds13002.pdf; ComponentLink1Description: http://www.diodes.com/datasheets/ds13002.pdf; Supplier Part Number 1: B140-FDITR-ND
FD1-FD3 = MECH_FIDUCIAL: Fiducial Marker
J1 = CON_MLX_39-28-1043: CONN HEADER 4POS 4.2MM VERT TIN; Manufacturer: Molex Inc; Connector Type: Header, Shrouded; Number of Positions: 4; Number of Positions Loaded: All; Pitch: 0.165" (4.20mm); Supplier 1: Digi-Key; ManufacturerPartNumber: 0039281043; RoHS: RoHS Compliant; Category: Connectors, Interconnects; Stock 1: 10185; Pricing 1: 1=0.73, 10=0.644, 25=0.606, 50=0.5808, 100=0.5555, 250=0.505, 500=0.4545, 1000=0.404, 2500=0.36612 (USD); Packaging: Tray; Contact Type: Male Pin; Number of Rows: 2; Row Spacing: 0.165" (4.20mm); Contact Mating Length: -; Mounting Type: Through Hole; Termination: Solder; Fastening Type: Locking Ramp; Features: -; Contact Finish: Tin; Contact Finish Thickness: 35µin (0.90µm); Color: Natural; ComponentLink1URL: http://www.molex.com/pdm_docs/sd/039281043_sd.pdf; ComponentLink1Description: http://www.molex.com/pdm_docs/sd/039281043_sd.pdf; Supplier Part Number 1: WM3801-ND
L1 = MAG_SRN6045-220M: INDUCTOR POWER SHIELD 22UH SMD; Manufacturer: Bourns Inc.; Type: Wirewound; Material - Core: Ferrite; Inductance: 22µH; Tolerance: ±20%; Current Rating: 1.5A; Current - Saturation: 1.9A; Shielding: Shielded; DC Resistance (DCR): 142 mOhm Max; Frequency - Test: 100kHz; Supplier 1: Digi-Key; ManufacturerPartNumber: SRN6045-220M; RoHS: RoHS Compliant; Category: Inductors, Coils, Chokes; Stock 1: 3000; Pricing 1: 1000=0.204, 2000=0.18, 3000=0.162, 5000=0.1596, 10000=0.156, 25000=0.15, 50000=0.147 (USD); Packaging: Tape & Reel (TR); Q @ Freq: -; Frequency - Self Resonant: -; Operating Temperature: -40°C ~ 125°C; Mounting Type: Surface Mount; Package / Case: Non Standard; Size / Dimension: 0.236" L x 0.236" W (6.00mm x 6.00mm); Height - Seated (Max): 0.177" (4.50mm); Supplier Device Package: -; ComponentLink1URL: http://www.bourns.com/data/global/pdfs/SRN6045.pdf; ComponentLink1Description: http://www.bourns.com/data/global/pdfs/SRN6045.pdf; Supplier Part Number 1: SRN6045-220MTR-ND
LED4 = LED_HSMG-C190: LED 570NM GREEN DIFF 0603 SMD; Manufacturer: Avago Technologies US Inc.; Wavelength - Dominant: 572nm; Millicandela Rating: 15mcd; Voltage - Forward (Vf) Typ: 2.2V; Current - Test: 20mA; Viewing Angle: 170°; Lens Type: Diffused; Lens Style/Size: Rectangle with Flat Top, 1mm x 0.8mm; Supplier 1: Digi-Key; ManufacturerPartNumber: HSMG-C190; RoHS: RoHS Compliant; Category: Optoelectronics; Stock 1: 28000; Pricing 1: 4000=0.08, 8000=0.072, 12000=0.064, 28000=0.06, 100000=0.052 (USD); Packaging: Tape & Reel (TR); Color: Green; Wavelength - Peak: 570nm; Package / Case: 0603 (1608 Metric); Size / Dimension: 1.60mm L x 0.80mm W; Height: 0.80mm; Mounting Type: Surface Mount; Luminous Flux @ Current - Test: -; ComponentLink1URL: http://www.avagotech.com/docs/AV02-0551EN; ComponentLink1Description: http://www.avagotech.com/docs/AV02-0551EN; Supplier Part Number 1: 516-1425-2-ND
LG1 = 5DPRINT: 5D PRINT SILKSCREEN LOGO
LG2 = ESD: ESD WARNING SILKSCREEN LOGO
LG3 = LEADFREE: Pb-FREE SILKSCREEN LOGO
LG4 = OSHW_COG: OSHW COG SILKSCREEN LOGO
LG6 = RoHS: RoHS SILKSCREEN LOGO
MH1 MH2 = MECH_MH-M3: M3 Mounting Hole
MH3 = MECH_MH-M3-NP: M3 Mounting Hole - no pad, unplated
NT1 = NET_TIE: NET TIE
Q5 = FETP_SIS427EDN-T1-GE3: MOSFET P-CHAN 30V 1212-8; Manufacturer: Vishay Siliconix; FET Type: MOSFET P-Channel, Metal Oxide; FET Feature: Standard; Current - Continuous Drain (Id) @ 25° C: 50A (Tc); Rds On (Max) @ Id, Vgs: 10.6 mOhm @ 11A, 10V; Vgs(th) (Max) @ Id: 2.5V @ 250µA; Gate Charge (Qg) @ Vgs: 66nC @ 10V; Input Capacitance (Ciss) @ Vds: 1930pF @ 15V; Power - Max: 52W; Supplier 1: Digi-Key; ManufacturerPartNumber: SIS427EDN-T1-GE3; RoHS: RoHS Compliant; Category: Discrete Semiconductor Products; Stock 1: 0; Pricing 1: 3000=0.261, 6000=0.243, 15000=0.234, 30000=0.225, 75000=0.2214, 150000=0.216 (USD); Packaging: Tape & Reel (TR); Drain to Source Voltage (Vdss): 30V; Mounting Type: Surface Mount; Package / Case: PowerPAK® 1212-8; Supplier Device Package: PowerPAK® 1212-8; ComponentLink1URL: http://www.vishay.com/docs/62856/sis427edn.pdf; ComponentLink1Description: http://www.vishay.com/docs/62856/sis427edn.pdf; Supplier Part Number 1: SIS427EDN-T1-GE3TR-ND
R55 = R0603-5K6-0.1W-1%: RES 5.60K OHM 1/10W 1% 0603 SMD; Manufacturer: Yageo; ManufacturerPartNumber: RC0603FR-075K6L; Power (Watts): 0.1W, 1/10W; Temperature Coefficient: ±100ppm/°C; Supplier 1: Digi-Key; RoHS: RoHS Compliant; Category: Resistors; Stock 1: 140000; Pricing 1: 5000=0.00171, 10000=0.00149, 25000=0.00131, 50000=0.0012, 125000=0.00117 (USD); Packaging: Tape & Reel (TR); Resistance: 5K6; Tolerance: ±1%; Composition: Thick Film; Features: -; Package / Case: 0603 (1608 Metric); Supplier Device Package: 0603; Size / Dimension: 0.063" L x 0.031" W (1.60mm x 0.80mm); Height: 0.022" (0.55mm); Number of Terminations: 2; ComponentLink1URL: http://www.yageo.com/documents/recent/PYu-RC0603_51_RoHS_L_4.pdf; ComponentLink1Description: http://www.yageo.com/documents/recent/PYu-RC0603_51_RoHS_L_4.pdf; Supplier Part Number 1: 311-5.60KHRTR-ND
R56 R57 = R0603-1K-0.1W-1%: as R51 on sheet 5DPD8_v1.0_OS_Sheet3; Supplier 1: Digi-Key; RoHS: RoHS Compliant; Category: Resistors; Stock 1: 1620000; Pricing 1: 5000=0.00171, 10000=0.00149, 25000=0.00131, 50000=0.0012, 125000=0.00117 (USD); Packaging: Tape & Reel (TR); Resistance: 1K; Tolerance: ±1%; Composition: Thick Film; Features: -; Package / Case: 0603 (1608 Metric); Supplier Device Package: 0603; Size / Dimension: 0.063" L x 0.031" W (1.60mm x 0.80mm); Height: 0.022" (0.55mm); Number of Terminations: 2; ComponentLink1URL: http://www.yageo.com/documents/recent/PYu-RC0603_51_RoHS_L_4.pdf; ComponentLink1Description: http://www.yageo.com/documents/recent/PYu-RC0603_51_RoHS_L_4.pdf; Supplier Part Number 1: 311-1.00KHRTR-ND
R60 = R0603-10K-0.1W-5%: as R32 on sheet 5DPD8_v1.0_OS_Sheet3; Supplier 1: Digi-Key; RoHS: RoHS Compliant; Category: Resistors; Stock 1: 0; Pricing 1: 5000=0.00131, 10000=0.00114, 25000=0.001, 50000=0.00092, 125000=0.0009 (USD); Packaging: Tape & Reel (TR); Resistance: 10K; Tolerance: ±5%; Composition: Thick Film; Features: -; Package / Case: 0603 (1608 Metric); Supplier Device Package: 0603; Size / Dimension: 0.063" L x 0.031" W (1.60mm x 0.80mm); Height: 0.022" (0.55mm); Number of Terminations: 2; ComponentLink1URL: http://www.yageo.com/documents/recent/PYu-RC0603_51_RoHS_L_4.pdf; ComponentLink1Description: http://www.yageo.com/documents/recent/PYu-RC0603_51_RoHS_L_4.pdf; Supplier Part Number 1: 311-10KGRTR-ND
U8 = IC_LMR14206XMKX/NOPB: IC REG BUCK ADJ 0.6A 6TSOT; Manufacturer: Texas Instruments; Output Type: Adjustable; Number of Outputs: 1; Voltage - Output: 0.765 V ~ 34 V; Voltage - Input: 4.5 V ~ 42 V; PWM Type: Current Mode; Frequency - Switching: 1.25MHz; Current - Output: 600mA; Synchronous Rectifier: No; Supplier 1: Digi-Key; ManufacturerPartNumber: LMR14206XMKX/NOPB; RoHS: RoHS Compliant; Category: Integrated Circuits (ICs); Stock 1: 0; Pricing 1: 3000=1.11375 (USD); Packaging: Tape & Reel (TR); Type: Step-Down (Buck); Operating Temperature: -40°C ~ 125°C; Mounting Type: Surface Mount; Package / Case: SOT-23-6 Thin, TSOT-23-6; Supplier Device Package: TSOT-23-6; ComponentLink1URL: http://www.ti.com/lit/ds/symlink/lmr14206.pdf; ComponentLink1Description: http://www.ti.com/lit/ds/symlink/lmr14206.pdf; Supplier Part Number 1: LMR14206XMKX/NOPB-ND
U9 = IC_AP7313-33SAG-7: IC REG LDO 3.3V 0.15A SOT23-3; Manufacturer: Diodes Inc; Number of Regulators: 1; Regulator Topology: Positive Fixed; Voltage - Input: Up to 6V; Voltage - Dropout (Typical): 0.15V @ 150mA; Current - Output: 150mA (Max); Current - Limit (Min): 200mA; Supplier 1: Digi-Key; ManufacturerPartNumber: AP7313-33SAG-7; RoHS: RoHS Compliant; Category: Integrated Circuits (ICs); Stock 1: 6000; Pricing 1: 3000=0.1122, 6000=0.1054, 15000=0.0986, 30000=0.09044, 75000=0.08704, 150000=0.08364 (USD); Packaging: Tape & Reel (TR); Voltage - Output: 3.3V; Operating Temperature: -40°C ~ 85°C; Mounting Type: Surface Mount; Package / Case: TO-236-3, SC-59, SOT-23-3; Supplier Device Package: SOT-23-3; ComponentLink1URL: http://www.diodes.com/datasheets/AP7313.pdf; ComponentLink1Description: http://www.diodes.com/datasheets/AP7313.pdf; Supplier Part Number 1: AP7313-33SAG-7DITR-ND

## Nets that join several sheets
3V3: 5DPD8_v1.0_OS_Sheet1 (5 pins), 5DPD8_v1.0_OS_Sheet4 (C58.2 TP47.1 U9.2)
5V: 5DPD8_v1.0_OS_Sheet1 (16 pins), 5DPD8_v1.0_OS_Sheet2 (22 pins), 5DPD8_v1.0_OS_Sheet3 (8 pins), 5DPD8_v1.0_OS_Sheet4 (8 pins)
24V: 5DPD8_v1.0_OS_Sheet2 (22 pins), 5DPD8_v1.0_OS_Sheet3 (11 pins), 5DPD8_v1.0_OS_Sheet4 (9 pins)
A5V: 5DPD8_v1.0_OS_Sheet1 (5 pins), 5DPD8_v1.0_OS_Sheet3 (D2.2 D4.2 R34.2 R41.2)
GND: 5DPD8_v1.0_OS_Sheet1 (36 pins), 5DPD8_v1.0_OS_Sheet2 (24 pins), 5DPD8_v1.0_OS_Sheet3 (26 pins), 5DPD8_v1.0_OS_Sheet4 (18 pins)
BUZ_DRV: 5DPD8_v1.0_OS_Sheet1 (U1.35), 5DPD8_v1.0_OS_Sheet3 (R35.1 R38.2 TP29.1)
~{E_EN}: 5DPD8_v1.0_OS_Sheet1 (U1.36), 5DPD8_v1.0_OS_Sheet2 (R27.1 TP27.1 U5.23)
E_DIR: 5DPD8_v1.0_OS_Sheet1 (U1.44), 5DPD8_v1.0_OS_Sheet2 (TP22.1 U5.14)
E_MS1: 5DPD8_v1.0_OS_Sheet1 (U1.30), 5DPD8_v1.0_OS_Sheet2 (TP24.1 U5.5)
E_MS2: 5DPD8_v1.0_OS_Sheet1 (U1.29), 5DPD8_v1.0_OS_Sheet2 (TP26.1 U5.6)
E_STEP: 5DPD8_v1.0_OS_Sheet1 (U1.45), 5DPD8_v1.0_OS_Sheet2 (TP25.1 U5.11)
EM_STOP: 5DPD8_v1.0_OS_Sheet1 (U1.1), 5DPD8_v1.0_OS_Sheet3 (C47.2 R54.1 TP38.1)
FAN_DRV: 5DPD8_v1.0_OS_Sheet1 (U1.41), 5DPD8_v1.0_OS_Sheet3 (R42.1 R45.2 TP32.1)
HB_DRV: 5DPD8_v1.0_OS_Sheet1 (U1.39), 5DPD8_v1.0_OS_Sheet3 (R44.1 R46.2 TP34.1)
HB_THERM: 5DPD8_v1.0_OS_Sheet1 (U1.61), 5DPD8_v1.0_OS_Sheet3 (C42.2 D4.3 R43.1 TP33.1)
HE_DRV: 5DPD8_v1.0_OS_Sheet1 (U1.40), 5DPD8_v1.0_OS_Sheet3 (R37.1 R39.2 TP31.1)
HE_THERM: 5DPD8_v1.0_OS_Sheet1 (U1.60), 5DPD8_v1.0_OS_Sheet3 (C38.2 D2.3 R36.1 TP30.1)
SCL: 5DPD8_v1.0_OS_Sheet1 (U1.25), 5DPD8_v1.0_OS_Sheet2 (R25.1 TP21.1 U6.3)
SDA: 5DPD8_v1.0_OS_Sheet1 (U1.26), 5DPD8_v1.0_OS_Sheet2 (R24.1 TP23.1 U6.4)
~{X_EN}: 5DPD8_v1.0_OS_Sheet1 (U1.42), 5DPD8_v1.0_OS_Sheet2 (R8.1 TP15.1 U2.23)
X_DIR: 5DPD8_v1.0_OS_Sheet1 (U1.50), 5DPD8_v1.0_OS_Sheet2 (TP3.1 U2.14)
X_LIMIT: 5DPD8_v1.0_OS_Sheet1 (U1.19), 5DPD8_v1.0_OS_Sheet3 (C44.2 R51.1 TP35.1)
X_MS1: 5DPD8_v1.0_OS_Sheet1 (U1.15), 5DPD8_v1.0_OS_Sheet2 (TP6.1 U2.5)
X_MS2: 5DPD8_v1.0_OS_Sheet1 (U1.16), 5DPD8_v1.0_OS_Sheet2 (TP12.1 U2.6)
X_STEP: 5DPD8_v1.0_OS_Sheet1 (U1.51), 5DPD8_v1.0_OS_Sheet2 (TP9.1 U2.11)
~{Y_EN}: 5DPD8_v1.0_OS_Sheet1 (U1.38), 5DPD8_v1.0_OS_Sheet2 (R10.1 TP16.1 U3.23)
Y_DIR: 5DPD8_v1.0_OS_Sheet1 (U1.48), 5DPD8_v1.0_OS_Sheet2 (TP4.1 U3.14)
Y_LIMIT: 5DPD8_v1.0_OS_Sheet1 (U1.18), 5DPD8_v1.0_OS_Sheet3 (C45.2 R52.1 TP36.1)
Y_MS1: 5DPD8_v1.0_OS_Sheet1 (U1.34), 5DPD8_v1.0_OS_Sheet2 (TP7.1 U3.5)
Y_MS2: 5DPD8_v1.0_OS_Sheet1 (U1.33), 5DPD8_v1.0_OS_Sheet2 (TP13.1 U3.6)
Y_STEP: 5DPD8_v1.0_OS_Sheet1 (U1.49), 5DPD8_v1.0_OS_Sheet2 (TP10.1 U3.11)
~{Z_EN}: 5DPD8_v1.0_OS_Sheet1 (U1.37), 5DPD8_v1.0_OS_Sheet2 (R12.1 TP17.1 U4.23)
Z_DIR: 5DPD8_v1.0_OS_Sheet1 (U1.46), 5DPD8_v1.0_OS_Sheet2 (TP5.1 U4.14)
Z_LIMIT: 5DPD8_v1.0_OS_Sheet1 (U1.2), 5DPD8_v1.0_OS_Sheet3 (C46.2 R53.1 TP37.1)
Z_MS1: 5DPD8_v1.0_OS_Sheet1 (U1.32), 5DPD8_v1.0_OS_Sheet2 (TP8.1 U4.5)
Z_MS2: 5DPD8_v1.0_OS_Sheet1 (U1.31), 5DPD8_v1.0_OS_Sheet2 (TP14.1 U4.6)
Z_STEP: 5DPD8_v1.0_OS_Sheet1 (U1.47), 5DPD8_v1.0_OS_Sheet2 (TP11.1 U4.11)